# EAGLE schematic bt-lights (EAGLE 6.1)
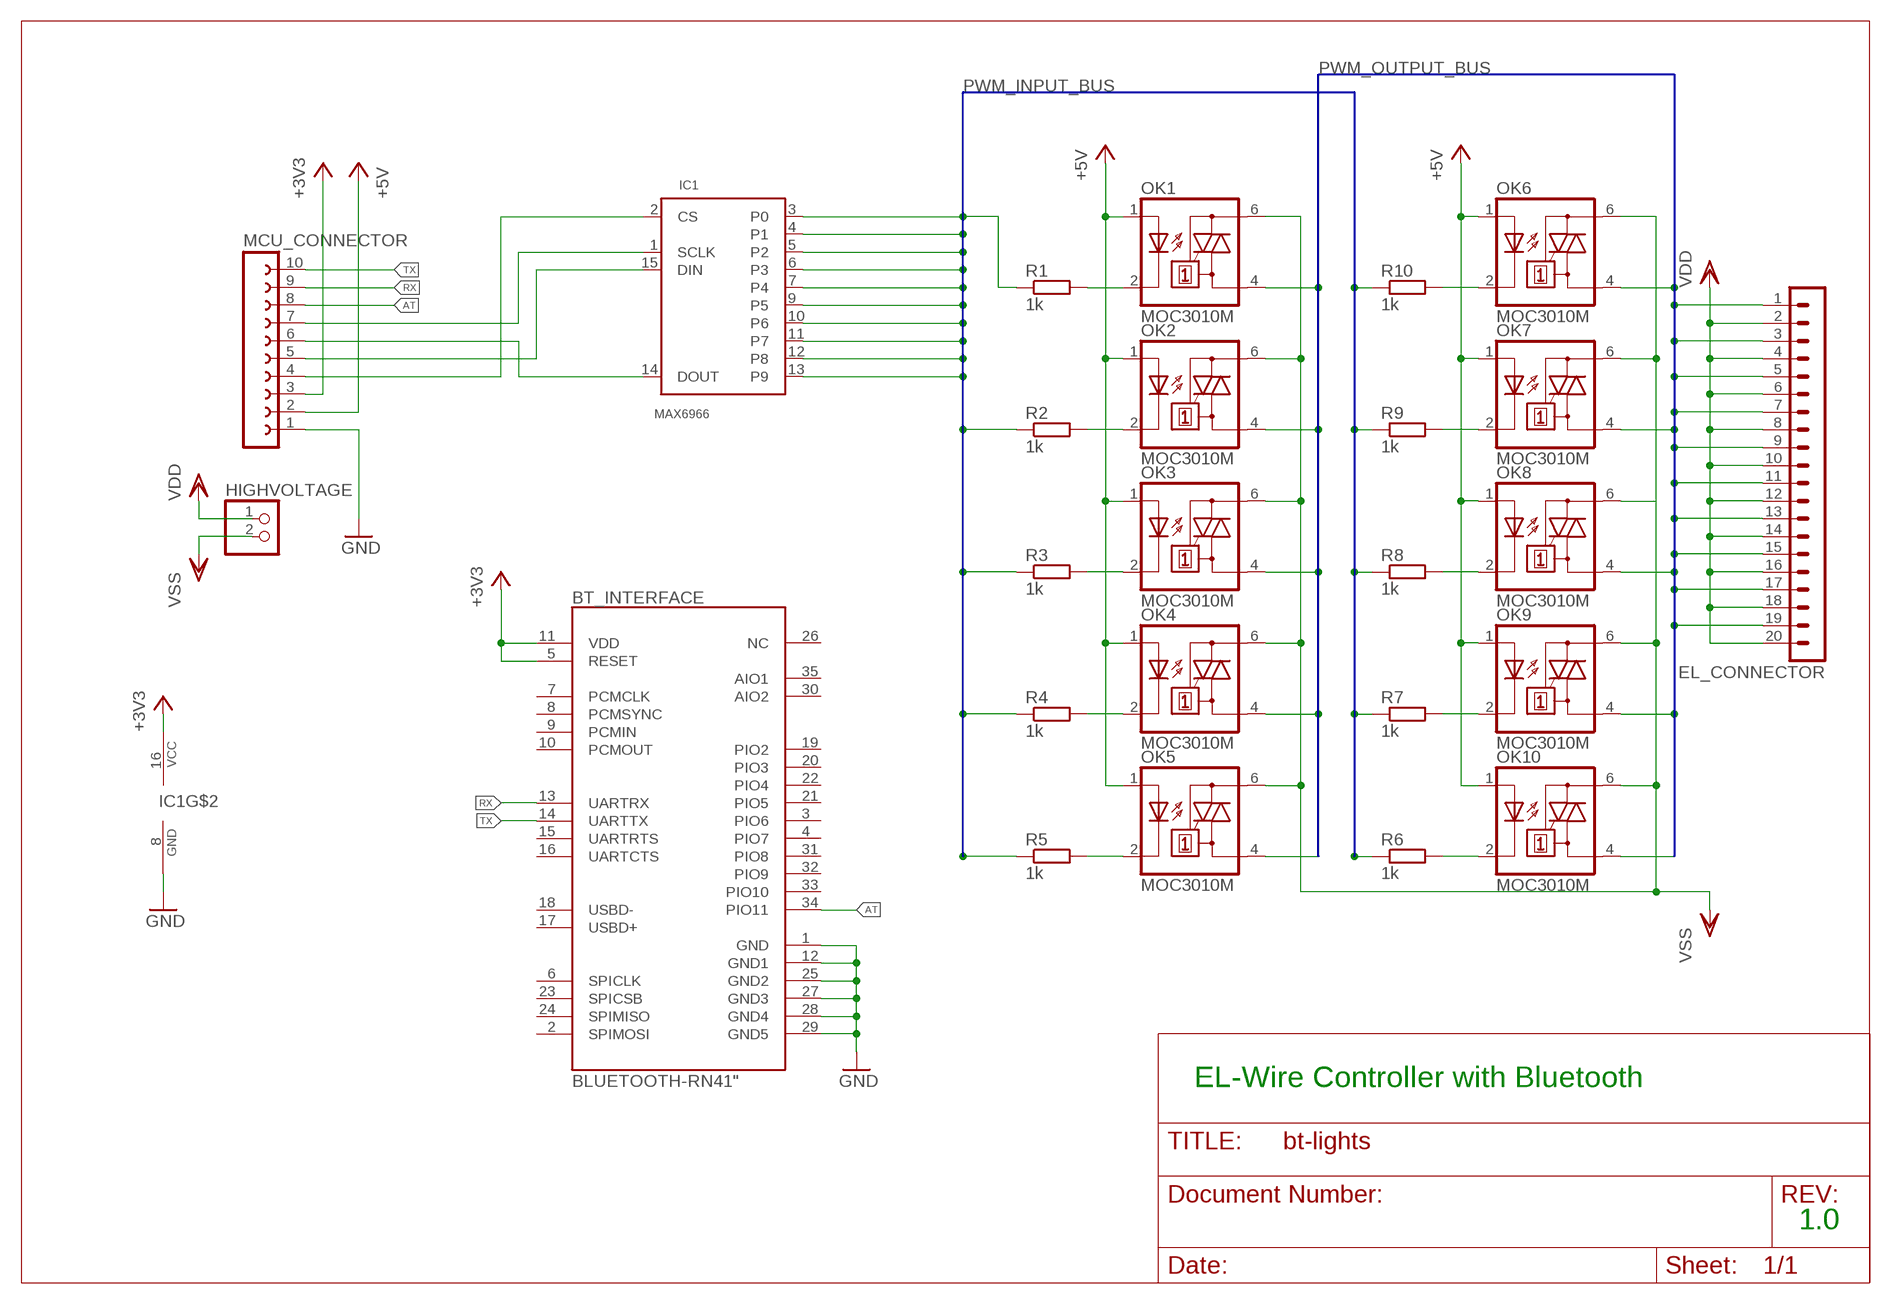
[diagram p0: schematic, sheet 1]

## Parts
BT_INTERFACE  BLUETOOTH-RN41"  [RN41]
EL_CONNECTOR  MA20-1L  [MA20-1L]
HIGHVOLTAGE  PINHD-1X2  [1X02]
IC1  MAX6966  MAX6966AEE  [QSOP16]
MCU_CONNECTOR  FE10-1  [FE10]
OK1  MOC3010M  [DIL06]
OK2  MOC3010M  [DIL06]
OK3  MOC3010M  [DIL06]
OK4  MOC3010M  [DIL06]
OK5  MOC3010M  [DIL06]
OK6  MOC3010M  [DIL06]
OK7  MOC3010M  [DIL06]
OK8  MOC3010M  [DIL06]
OK9  MOC3010M  [DIL06]
OK10  MOC3010M  [DIL06]
R1  1k  R-EU_0207/7  [0207/7]
R2  1k  R-EU_0207/7  [0207/7]
R3  1k  R-EU_0207/7  [0207/7]
R4  1k  R-EU_0207/7  [0207/7]
R5  1k  R-EU_0207/7  [0207/7]
R6  1k  R-EU_0207/7  [0207/7]
R7  1k  R-EU_0207/7  [0207/7]
R8  1k  R-EU_0207/7  [0207/7]
R9  1k  R-EU_0207/7  [0207/7]
R10  1k  R-EU_0207/7  [0207/7]

## Nets
+3V3: BT_INTERFACE.5(RESET) BT_INTERFACE.11(VDD) IC1.16(VCC) MCU_CONNECTOR.3
+5V: MCU_CONNECTOR.2 OK1.1(A) OK2.1(A) OK3.1(A) OK4.1(A) OK5.1(A) OK6.1(A) OK7.1(A) OK8.1(A) OK9.1(A) OK10.1(A)
AT: BT_INTERFACE.34(PIO11) MCU_CONNECTOR.8
GND: BT_INTERFACE.1(GND) BT_INTERFACE.12(GND1) BT_INTERFACE.25(GND2) BT_INTERFACE.27(GND3) BT_INTERFACE.28(GND4) BT_INTERFACE.29(GND5) IC1.8(GND) MCU_CONNECTOR.1
N$1: IC1.2(CS) MCU_CONNECTOR.4
N$2: IC1.1(SCLK) MCU_CONNECTOR.7
N$3: IC1.15(DIN) MCU_CONNECTOR.5
N$4: IC1.14(DOUT) MCU_CONNECTOR.6
N$5: OK1.2(C) R1.2
N$6: OK10.2(C) R6.2
N$7: OK9.2(C) R7.2
N$8: OK8.2(C) R8.2
N$9: OK7.2(C) R9.2
N$10: OK6.2(C) R10.2
N$11: OK2.2(C) R2.2
N$12: OK3.2(C) R3.2
N$13: OK4.2(C) R4.2
N$14: OK5.2(C) R5.2
N$P0: IC1.3(P0) R1.1
N$P1: IC1.4(P1) R2.1
N$P2: IC1.5(P2) R3.1
N$P3: IC1.6(P3) R4.1
N$P4: IC1.7(P4) R5.1
N$P5: IC1.9(P5) R10.1
N$P6: IC1.10(P6) R9.1
N$P7: IC1.11(P7) R8.1
N$P8: IC1.12(P8) R7.1
N$P9: IC1.13(P9) R6.1
OUT0: EL_CONNECTOR.1 OK1.4(A1)
OUT1: EL_CONNECTOR.3 OK2.4(A1)
OUT2: EL_CONNECTOR.5 OK3.4(A1)
OUT3: EL_CONNECTOR.7 OK4.4(A1)
OUT4: EL_CONNECTOR.9 OK5.4(A1)
OUT5: EL_CONNECTOR.11 OK6.4(A1)
OUT6: EL_CONNECTOR.13 OK7.4(A1)
OUT7: EL_CONNECTOR.15 OK8.4(A1)
OUT8: EL_CONNECTOR.17 OK9.4(A1)
OUT9: EL_CONNECTOR.19 OK10.4(A1)
RX: BT_INTERFACE.13(UARTRX) MCU_CONNECTOR.9
TX: BT_INTERFACE.14(UARTTX) MCU_CONNECTOR.10
VDD: EL_CONNECTOR.2 EL_CONNECTOR.4 EL_CONNECTOR.6 EL_CONNECTOR.8 EL_CONNECTOR.10 EL_CONNECTOR.12 EL_CONNECTOR.14 EL_CONNECTOR.16 EL_CONNECTOR.18 EL_CONNECTOR.20 HIGHVOLTAGE.1
VSS: HIGHVOLTAGE.2 OK1.6(A2) OK2.6(A2) OK3.6(A2) OK4.6(A2) OK5.6(A2) OK6.6(A2) OK7.6(A2) OK8.6(A2) OK9.6(A2) OK10.6(A2)
Unconnected: BT_INTERFACE.2(SPIMOSI) BT_INTERFACE.3(PIO6) BT_INTERFACE.4(PIO7) BT_INTERFACE.6(SPICLK) BT_INTERFACE.7(PCMCLK) BT_INTERFACE.8(PCMSYNC) BT_INTERFACE.9(PCMIN) BT_INTERFACE.10(PCMOUT) BT_INTERFACE.15(UARTRTS) BT_INTERFACE.16(UARTCTS) BT_INTERFACE.17(USBD+) BT_INTERFACE.18(USBD-) BT_INTERFACE.19(PIO2) BT_INTERFACE.20(PIO3) BT_INTERFACE.21(PIO5) BT_INTERFACE.22(PIO4) BT_INTERFACE.23(SPICSB) BT_INTERFACE.24(SPIMISO) BT_INTERFACE.26(NC) BT_INTERFACE.30(AIO2) BT_INTERFACE.31(PIO8) BT_INTERFACE.32(PIO9) BT_INTERFACE.33(PIO10) BT_INTERFACE.35(AIO1)

## Buses
PWM_INPUT_BUS
PWM_OUTPUT_BUS

## Notes on the sheet
- EL-Wire Controller with Bluetooth
- 1.0

## Library data of the parts
BT_INTERFACE = SparkFun-RF:BLUETOOTH-RN41: Bluetooth SMD module
EL_CONNECTOR = con-lstb:MA20-1L: PIN HEADER; OC_FARNELL: unknown; OC_NEWARK: unknown
HIGHVOLTAGE = pinhead:PINHD-1X2: PIN HEADER
IC1 = max696x:MAX6966AEE
MCU_CONNECTOR = con-lsta:FE10-1: FEMALE HEADER; OC_FARNELL: unknown; OC_NEWARK: unknown
OK1-OK10 = optocoupler:MOC30*M: RANDOM-PHASE OPTOISOLATORS TRIAC DRIVER OUTPUT Source: http://www.fairchildsemi.com MOC3020-M.pdf; MF: FAIRCHILD SEMICONDUCTOR; MPN: MOC3010-M; OC_FARNELL: 1505423; OC_NEWARK: 72K8892
R1-R10 = resistor:R-EU_: RESISTOR, European symbol